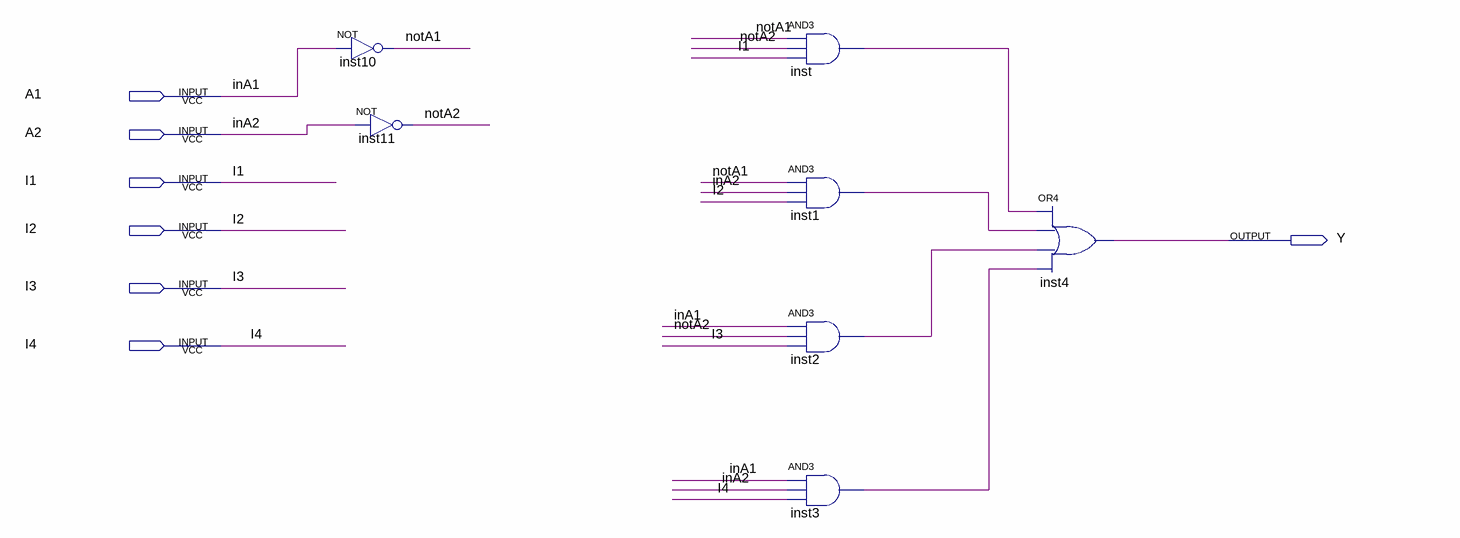
[diagram p0: schematic sheet]
// Quartus schematic ex1p3.bdf as structural Verilog: 7 symbols, 7 pins
module ex1p3 (
  input  A1,
  input  A2,
  input  I1,
  input  I2,
  input  I3,
  input  I4,
  output Y
);

  wire inst1_out, inst2_out, inst3_out, inst_out, notA1, notA2;

  not inst10 (notA1, A1);
  not inst11 (notA2, A2);
  and inst (inst_out, notA1, notA2, I1);
  and inst1 (inst1_out, notA1, A2, I2);
  and inst2 (inst2_out, A1, notA2, I3);
  and inst3 (inst3_out, A1, A2, I4);
  or inst4 (Y, inst_out, inst1_out, inst2_out, inst3_out);

  // Other names for the same wires on the sheet: inA1 = A1; inA2 = A2
endmodule
